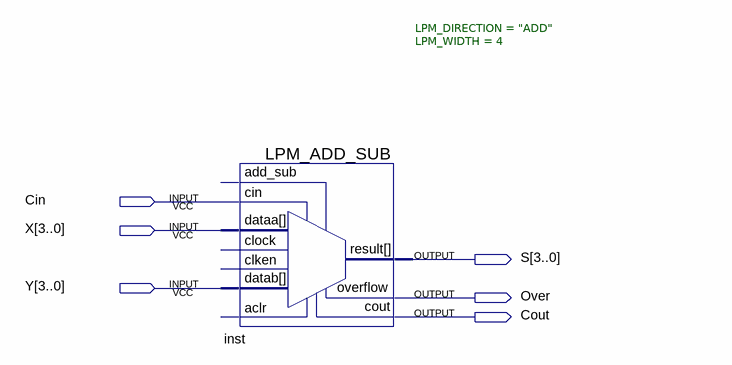
[diagram p0: schematic sheet]
// Quartus schematic lab5c.bdf as structural Verilog: 1 symbols, 6 pins
module lab5c (
  input  Cin,
  input  [3:0] X,
  input  [3:0] Y,
  output [3:0] S,
  output Over,
  output Cout
);

  LPM_ADD_SUB #(.LPM_DIRECTION("ADD"), .LPM_WIDTH(4)) inst (
    .datab(Y), .dataa(X), .cin(Cin), .cout(Cout), .overflow(Over), .result(S));  // open: add_sub, aclr, clock, clken
endmodule
